# Altium schematic sheet Sheet1.SchDoc
size A3
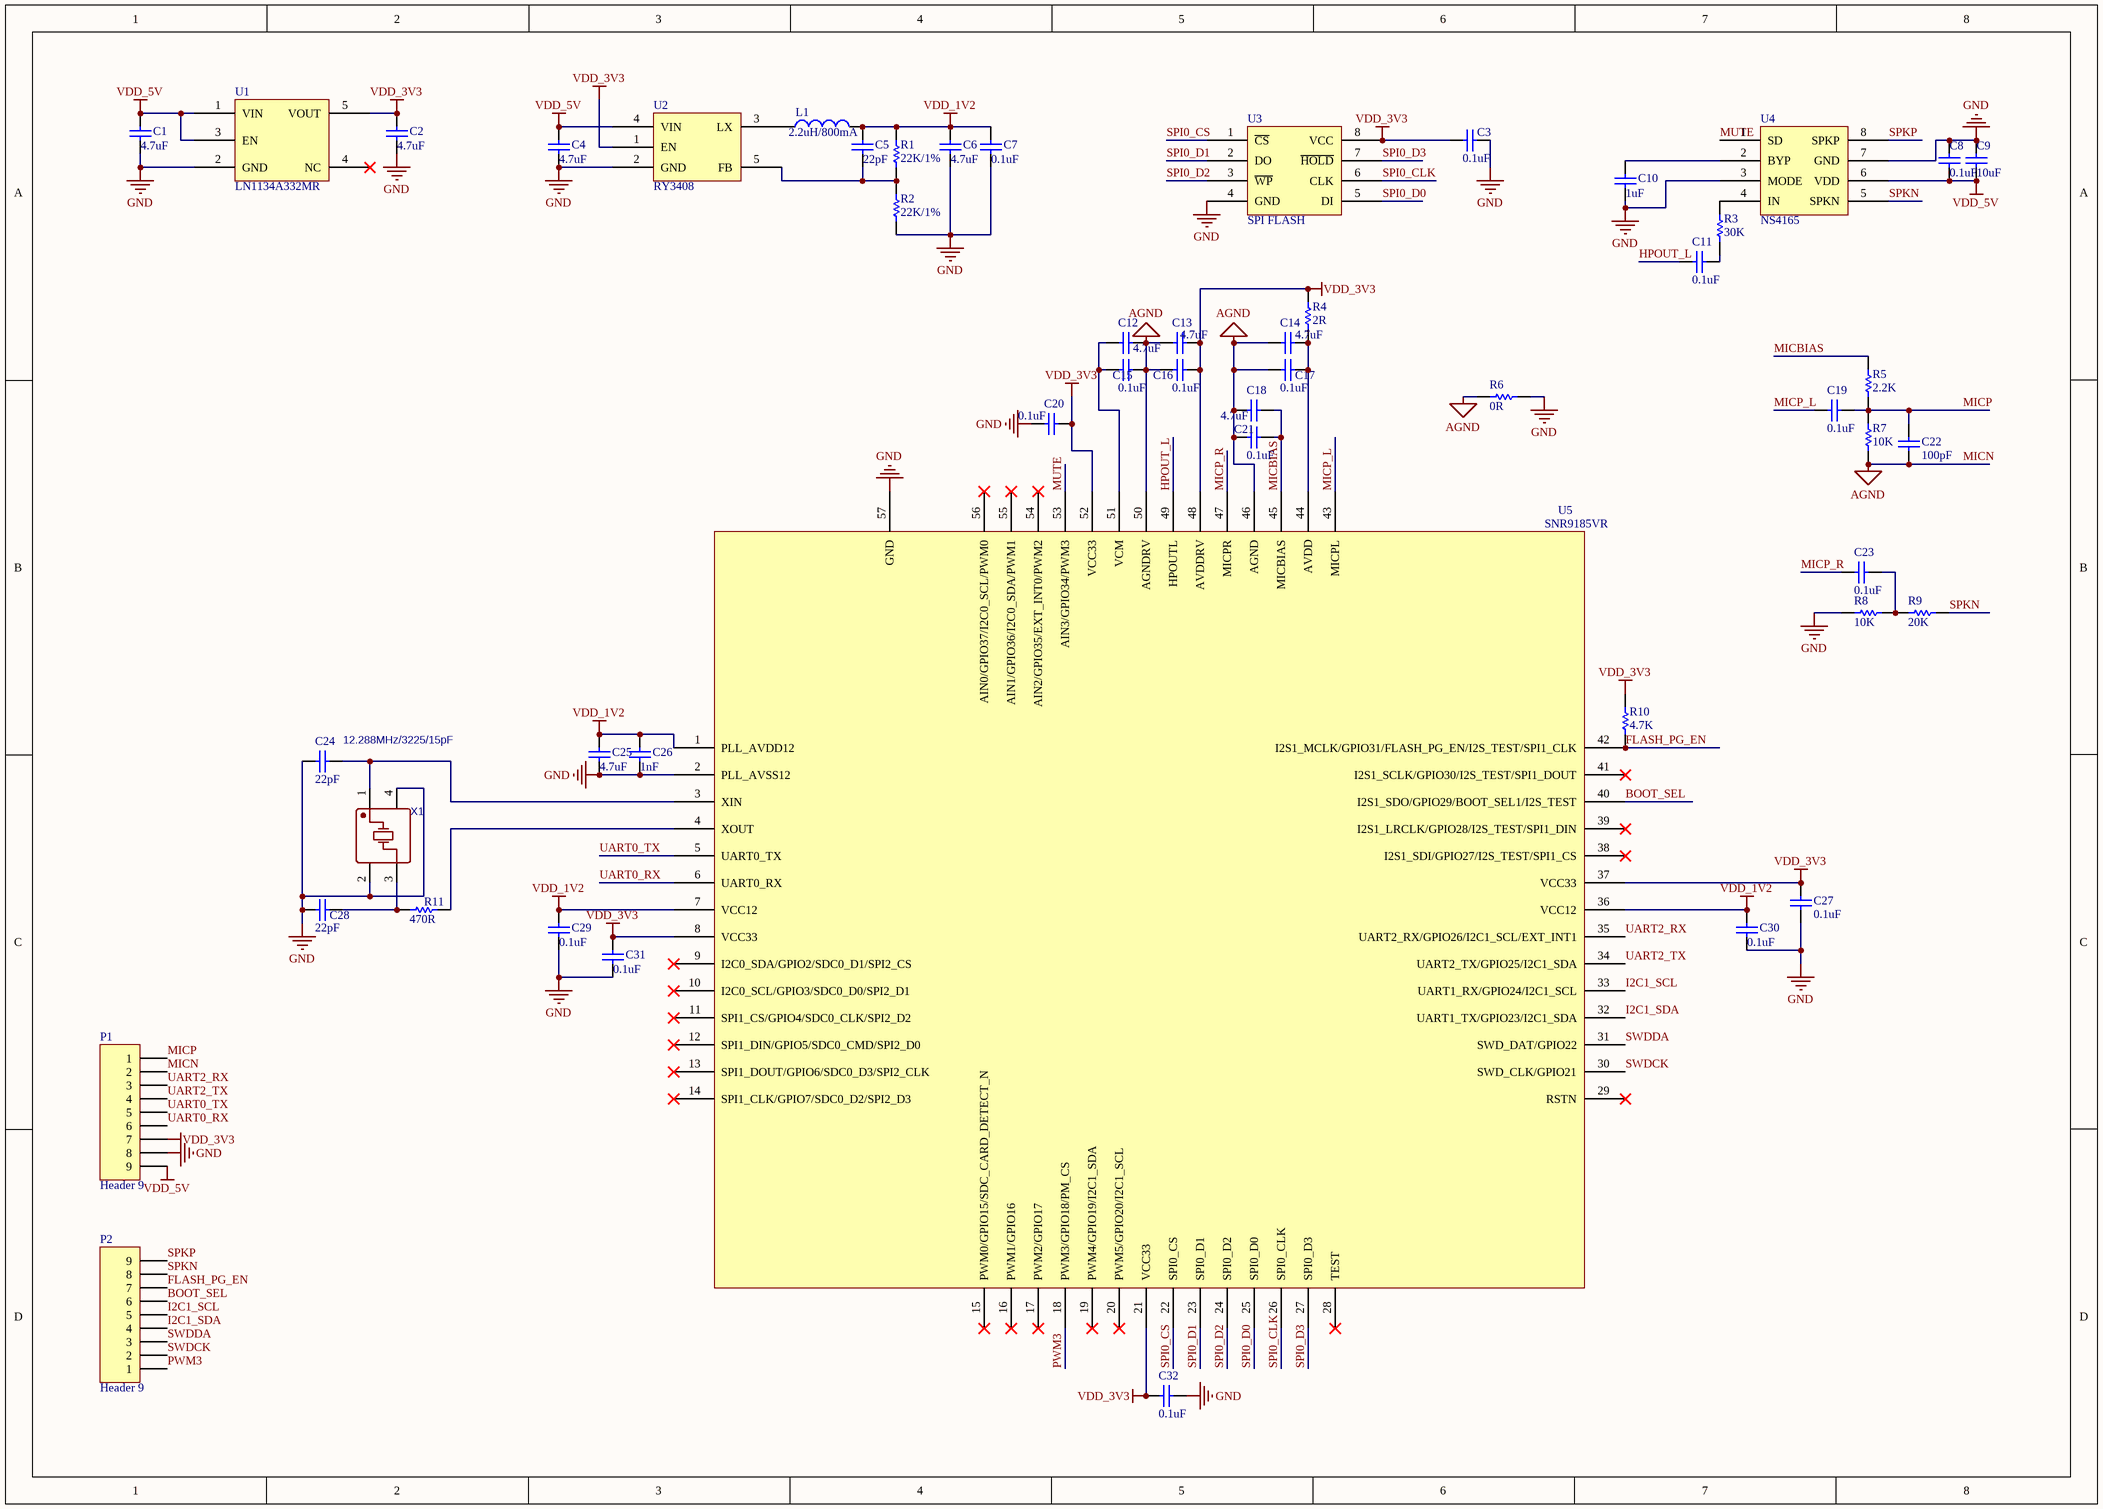
[diagram p0: Sheet1.SchDoc]

## Parts
C1  value 4.7uF  [C0402]  (hidden comment: Cap)
C2  value 4.7uF  [C0402]  (hidden comment: Cap)
C3  value 0.1uF  [C0402]  (hidden comment: Cap)
C4  value 4.7uF  [C0402]  (hidden comment: Cap)
C5  value 22pF  [C0402]  (hidden comment: Cap)
C6  value 4.7uF  [C0402]  (hidden comment: Cap)
C7  value 0.1uF  [C0402]  (hidden comment: Cap)
C8  value 0.1uF  [C0402]  (hidden comment: Cap)
C9  value 10uF  [C0603]  (hidden comment: Cap)
C10  value 1uF  [C0402]  (hidden comment: Cap)
C11  value 0.1uF  [C0402]  (hidden comment: Cap)
C12  value 4.7uF  [C0402]  (hidden comment: Cap)
C13  value 4.7uF  [C0402]  (hidden comment: Cap)
C14  value 4.7uF  [C0402]  (hidden comment: Cap)
C15  value 0.1uF  [C0402]  (hidden comment: Cap)
C16  value 0.1uF  [C0402]  (hidden comment: Cap)
C17  value 0.1uF  [C0402]  (hidden comment: Cap)
C18  value 4.7uF  [C0402]  (hidden comment: Cap)
C19  value 0.1uF  [C0402]  (hidden comment: Cap)
C20  value 0.1uF  [C0402]  (hidden comment: Cap)
C21  value 0.1uF  [C0402]  (hidden comment: Cap)
C22  value 100pF  [C0402]  (hidden comment: Cap)
C23  value 0.1uF  [C0402]  (hidden comment: Cap)
C24  value 22pF  [C0402]  (hidden comment: Cap)
C25  value 4.7uF  [C0402]  (hidden comment: Cap)
C26  value 1nF  [C0402]  (hidden comment: Cap)
C27  value 0.1uF  [C0402]  (hidden comment: Cap)
C28  value 22pF  [C0402]  (hidden comment: Cap)
C29  value 0.1uF  [C0402]  (hidden comment: Cap)
C30  value 0.1uF  [C0402]  (hidden comment: Cap)
C31  value 0.1uF  [C0402]  (hidden comment: Cap)
C32  value 0.1uF  [C0402]  (hidden comment: Cap)
L1  value 2.2uH/800mA  [0805_L]  (hidden comment: Inductor)
P1  Header 9  [Header 1*9P 2.54mm-2]
P2  Header 9  [Header 1*9P 2.54mm-2]
R1  value 22K/1%  [R0402]  (hidden comment: Res1)
R2  value 22K/1%  [R0402]  (hidden comment: Res1)
R3  value 30K  [R0402]  (hidden comment: Res1)
R4  value 2R  [R0402]  (hidden comment: Res1)
R5  value 2.2K  [R0402]  (hidden comment: Res1)
R6  value 0R  [R0402]  (hidden comment: Res1)
R7  value 10K  [R0402]  (hidden comment: Res1)
R8  value 10K  [R0402]  (hidden comment: Res1)
R9  value 20K  [R0402]  (hidden comment: Res1)
R10  value 4.7K  [R0402]  (hidden comment: Res1)
R11  value 470R  [R0402]  (hidden comment: Res1)
U1  LN1134A332MR  [SOT-23-5]
U2  RY3408  [SOT-23-5]
U3  SPI FLASH  [SOIC-8_208MIL]
U4  NS4165  [NS4165]
U5  SNR9185VR  [QFN-56_L7.0-W7.0-P0.40-BL-EP5.1]
X1  12.288MHz/3225/15pF  [OSC-SMD_4P-L3.2-W2.5-BL]

## Nets
GND: C1.1 C2.1 C3.1 C4.1 C6.1 C7.1 C8.1 C9.2 C10.1 C20.1 C24.2 C25.1 C26.1 C27.1 C28.2 C29.1 C30.1 C31.1 C32.1 P1.8 R2.1 R6.1 R8.2 U1.2(GND) U2.2(GND) U3.4(GND) U4.3(MODE) U4.7(GND) U5.2(PLL_AVSS12) U5.57(GND) X1.2(GND) X1.4(GND)
MICN: C12.2 C13.1 C14.2 C15.1 C16.2 C17.1 C18.1 C21.2 C22.2 P1.2 R6.2 R7.1 U5.46(AGND) U5.50(AGNDRV)  [also labelled AGND]
VDD_1V2: C5.2 C6.2 C7.2 C25.2 C26.2 C29.2 C30.2 L1.2 R1.2 U5.1(PLL_AVDD12) U5.7(VCC12) U5.36(VCC12)
VDD_3V3: C2.2 C3.2 C13.2 C16.1 C20.2 C27.2 C31.2 C32.2 P1.7 R4.1 R10.1 U1.5(VOUT) U2.1(EN) U3.8(VCC) U5.8(VCC33) U5.21(VCC33) U5.37(VCC33) U5.48(AVDDRV) U5.52(VCC33)
VDD_5V: C1.2 C4.2 C8.2 C9.1 P1.9 U1.1(VIN) U1.3(EN) U2.4(VIN) U4.6(VDD)
BOOT_SEL: P2.6 U5.40(I2S1_SDO/GPIO29/BOOT_SEL1/I2S_TEST)
FLASH_PG_EN: P2.7 R10.2 U5.42(I2S1_MCLK/GPIO31/FLASH_PG_EN/I2S_TEST/SPI1_CLK)
HPOUT_L: C11.1 U5.49(HPOUTL)
I2C1_SCL: P2.5 U5.33(UART1_RX/GPIO24/I2C1_SCL)
I2C1_SDA: P2.4 U5.32(UART1_TX/GPIO23/I2C1_SDA)
MICBIAS: C18.2 C21.1 R5.2 U5.45(MICBIAS)
MICP: C19.1 C22.1 P1.1 R5.1 R7.2
MICP_L: C19.2 U5.43(MICPL)
MICP_R: C23.2 U5.47(MICPR)
MUTE: U4.1(SD) U5.53(AIN3/GPIO34/PWM3)
PWM3: P2.1 U5.18(PWM3/GPIO18/PM_CS)
SPI0_CLK: U3.6(CLK) U5.26(SPI0_CLK)
SPI0_CS: U3.1(~{CS}) U5.22(SPI0_CS)
SPI0_D0: U3.5(DI) U5.25(SPI0_D0)
SPI0_D1: U3.2(DO) U5.23(SPI0_D1)
SPI0_D2: U3.3(~{WP}) U5.24(SPI0_D2)
SPI0_D3: U3.7(~{HOLD}) U5.27(SPI0_D3)
SPKN: P2.8 R9.1 U4.5(SPKN)
SPKP: P2.9 U4.8(SPKP)
SWDCK: P2.2 U5.30(SWD_CLK/GPIO21)
SWDDA: P2.3 U5.31(SWD_DAT/GPIO22)
UART0_RX: P1.6 U5.6(UART0_RX)
UART0_TX: P1.5 U5.5(UART0_TX)
UART2_RX: P1.3 U5.35(UART2_RX/GPIO26/I2C1_SCL/EXT_INT1)
UART2_TX: P1.4 U5.34(UART2_TX/GPIO25/I2C1_SDA)
NetC5_1: C5.1 R1.1 R2.2 U2.5(FB)
NetC10_2: C10.2 U4.2(BYP)
NetC11_2: C11.2 R3.2
NetC12_1: C12.1 C15.2 U5.51(VCM)
NetC14_1: C14.1 C17.2 R4.2 U5.44(AVDD)
NetC23_1: C23.1 R8.1 R9.2
NetC24_1: C24.1 U5.3(XIN) X1.1(OE#)
NetC28_1: C28.1 R11.2 X1.3(OUT)
NetL1_1: L1.1 U2.3(LX)
NetR3_1: R3.1 U4.4(IN)
NetR11_1: R11.1 U5.4(XOUT)

Not connected (* = marked no-connect by the designer): U1 4(NC)*; U5 9(I2C0_SDA/GPIO2/SDC0_D1/SPI2_CS)* 10(I2C0_SCL/GPIO3/SDC0_D0/SPI2_D1)* 11(SPI1_CS/GPIO4/SDC0_CLK/SPI2_D2)* 12(SPI1_DIN/GPIO5/SDC0_CMD/SPI2_D0)* 13(SPI1_DOUT/GPIO6/SDC0_D3/SPI2_CLK)* 14(SPI1_CLK/GPIO7/SDC0_D2/SPI2_D3)* 15(PWM0/GPIO15/SDC_CARD_DETECT_N)* 16(PWM1/GPIO16)* 17(PWM2/GPIO17)* 19(PWM4/GPIO19/I2C1_SDA)* 20(PWM5/GPIO20/I2C1_SCL)* 28(TEST)* 29(RSTN)* 38(I2S1_SDI/GPIO27/I2S_TEST/SPI1_CS)* 39(I2S1_LRCLK/GPIO28/I2S_TEST/SPI1_DIN)* 41(I2S1_SCLK/GPIO30/I2S_TEST/SPI1_DOUT)* 54(AIN2/GPIO35/EXT_INT0/PWM2)* 55(AIN1/GPIO36/I2C0_SDA/PWM1)* 56(AIN0/GPIO37/I2C0_SCL/PWM0)*

## Library data of the parts
C1-C32 = Cap: Capacitor; Published: 8-Jun-2000; LatestRevisionDate: 17-Jul-2002; LatestRevisionNote: Re-released for DXP Platform.; PackageReference: RAD-0.3; Publisher: Altium Limited; PackageDescription: Radial Cap, Thru-Hole; 2 Leads; 0.3 in Pin Spacing
L1 = Inductor: Code_IEC: 1005; Published: 8-Jun-2000; LatestRevisionDate: 29-May-2009; LatestRevisionNote: IPC-7351 Footprint Added.; PackageReference: 0402-A; Publisher: Altium Limited; PackageDescription: Chip Inductor; Code_JEITA: 0402
P1 P2 = Header 9: Header, 9-Pin; LatestRevisionDate: 17-Jul-2002; LatestRevisionNote: Re-released for DXP Platform.; Publisher: Altium Limited
R1-R11 = Res1: Resistor; Published: 8-Jun-2000; LatestRevisionDate: 17-Jul-2002; LatestRevisionNote: Re-released for DXP Platform.; PackageReference: AXIAL-0.3; Publisher: Altium Limited; PackageDescription: Axial Device, Thru-Hole; 2 Leads; 0.3 in Pin Spacing
U1 = LIN1134A332MR
X1 = 12.288MHz: BOM_Manufacturer: Zhejiang Abel Elec; BOM_Manufacturer Part: SMD-3225_4P 12.288MHZ 12PF; nameAlias: Frequency; Contributor: LCSC; SMT Type: Extend; BOM_Supplier: LCSC; BOM_Supplier Part: C362472; BOM_LCSC Assembly: Yes; spicePre: X; spiceSymbolName: SMD-3225_4P 12.288MHZ 12PF